# Altium schematic sheet Misc Controls.SchDoc
size C; SheetNumber: 6; SheetTotal: 7
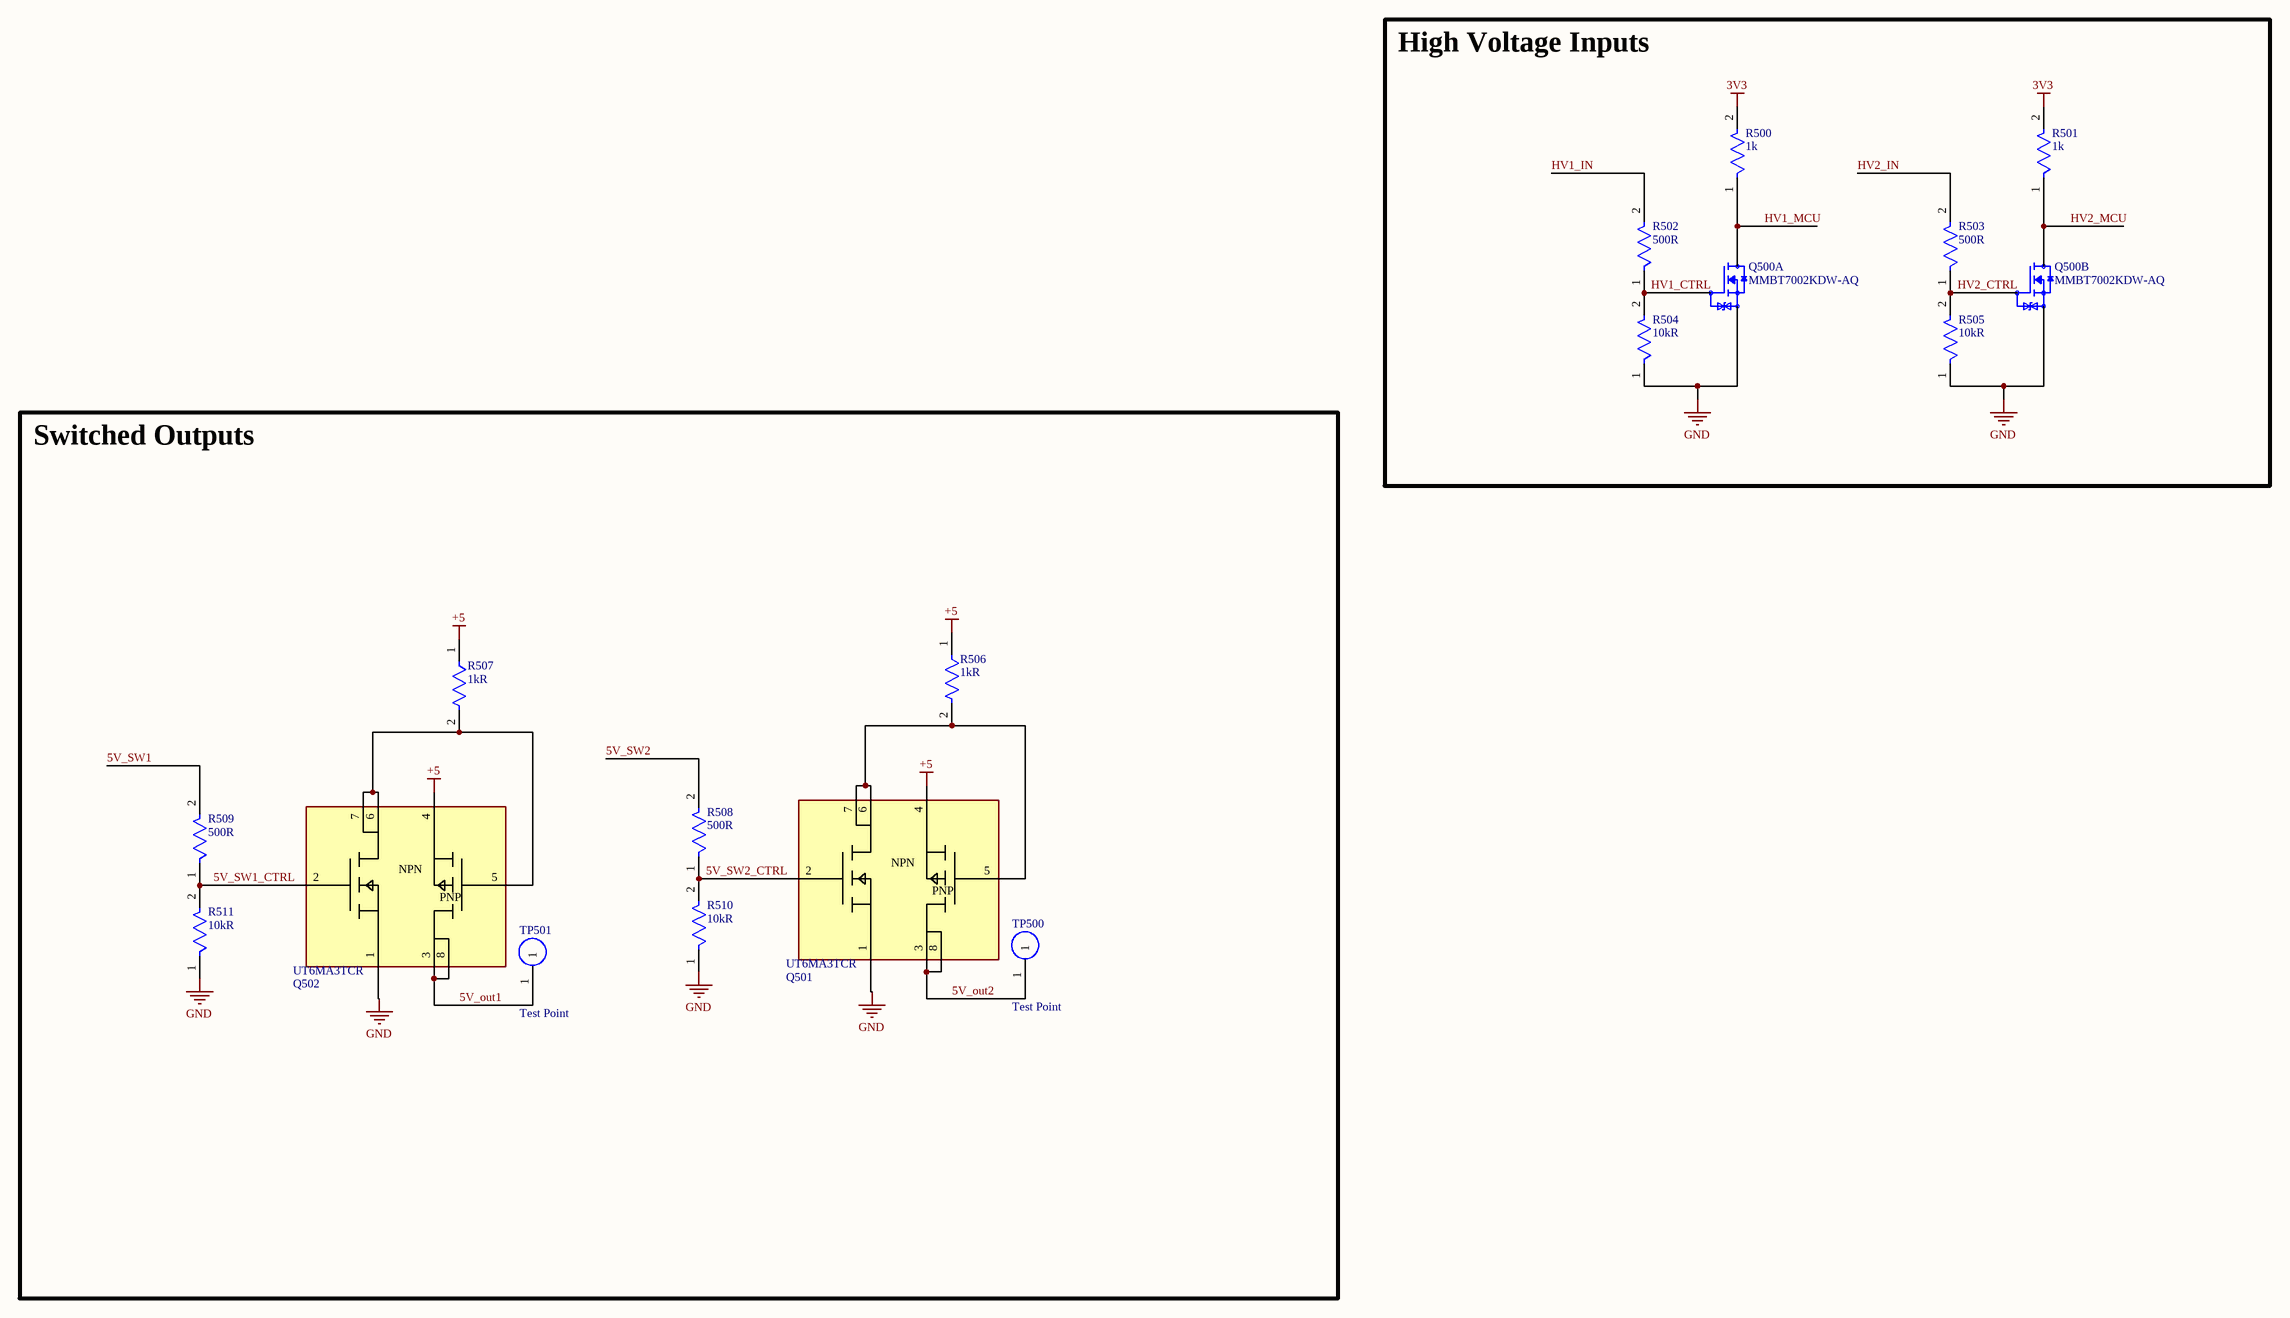
[diagram p0: Misc Controls.SchDoc]

## Parts
Q500  MMBT7002KDW-AQ  [SOT65P210X100-6N]  (parts A,B of 2)
Q501  UT6MA3TCR  [TRANS_UT6J3_ROM]
Q502  UT6MA3TCR  [TRANS_UT6J3_ROM]
R500  value 1k  [FP-CPF0603-MFG]  (hidden comment: CPF0603B2K15E1)
R501  value 1k  [FP-CPF0603-MFG]  (hidden comment: CPF0603B2K15E1)
R502  value 500R  [FP-CPF0603-MFG]  (hidden comment: CPF0603B2K15E1)
R503  value 500R  [FP-CPF0603-MFG]  (hidden comment: CPF0603B2K15E1)
R504  value 10kR  [FP-CPF0603-MFG]  (hidden comment: CPF0603B2K15E1)
R505  value 10kR  [FP-CPF0603-MFG]  (hidden comment: CPF0603B2K15E1)
R506  value 1kR  [FP-CPF0603-MFG]  (hidden comment: CPF0603B2K15E1)
R507  value 1kR  [FP-CPF0603-MFG]  (hidden comment: CPF0603B2K15E1)
R508  value 500R  [FP-CPF0603-MFG]  (hidden comment: CPF0603B2K15E1)
R509  value 500R  [FP-CPF0603-MFG]  (hidden comment: CPF0603B2K15E1)
R510  value 10kR  [FP-CPF0603-MFG]  (hidden comment: CPF0603B2K15E1)
R511  value 10kR  [FP-CPF0603-MFG]  (hidden comment: CPF0603B2K15E1)
TP500  Test Point  [2mm TP]
TP501  Test Point  [2mm TP]

## Blocks framed on the sheet
High Voltage Inputs: Q500 R500-R505
Switched Outputs: Q501 Q502 R506-R511 TP500 TP501

## Nets
3V3: R500.2 R501.2
+5: Q501.4 Q502.4 R506.1 R507.1
GND: Q500.1(S1) Q500.4(S2) Q501.1 Q502.1 R504.1 R505.1 R510.1 R511.1
5V_out1: Q502.3 Q502.8 TP501.1
5V_out2: Q501.3 Q501.8 TP500.1
5V_SW1: R509.2
5V_SW1_CTRL: Q502.2 R509.1 R511.2
5V_SW2: R508.2
5V_SW2_CTRL: Q501.2 R508.1 R510.2
HV1_CTRL: Q500.2(G1) R502.1 R504.2
HV1_IN: R502.2
HV1_MCU: Q500.6(D1) R500.1
HV2_CTRL: Q500.5(G2) R503.1 R505.2
HV2_IN: R503.2
HV2_MCU: Q500.3(D2) R501.1
NetQ501_5: Q501.5 Q501.6 Q501.7 R506.2
NetQ502_5: Q502.5 Q502.6 Q502.7 R507.2

## Notes on the sheet
- (in symbol CMP-009-00178-3) NPN; PNP

## Library data of the parts
Q500 = CMP-075-000000-1: MOSFET, SOT-363, N+N, 60V, 0.3A, 3â„; MF: Diotec Semiconductor; Value: *; Package: SOT-363 Diotec; Pin Count: 6; Source: MMBT7002KDW-AQ.SchLib; SnapEDA_Link: https://www.snapeda.com/parts/MMBT7002KDW-AQ/Diotec/view-part/?ref=snap; Design Item ID: MMBT7002KDW-AQ; MP: MMBT7002KDW-AQ; Check_prices: https://www.snapeda.com/parts/MMBT7002KDW-AQ/Diotec/view-part/?ref=eda; Component Type: Standard; PartId: 1
Q501 Q502 = CMP-009-00178-3: No Description Available; Mfr_Name: ROHM Semiconductor; Type: Type; Design Item ID: UT6MA3TCR; RefDes: RefDes; Source: UT6MA3TCR.SchLib
R500-R511 = CMP-03211-008657-1: RES SMD 2.15KΩ 0.1% 1/16W 0603; Manufacturer: TE Connectivity; Temperature Coefficient: 25ppm/°C; Voltage Rating: 50V; Power Rating: 0.063W; Height: 0.55mm; Series: CPF; ComponentLink2Description: Datasheet; Package: CPF0603; Automotive: No; octopart_url: https://octopart.com/cpf0603b2k15e1-te+connectivity-22739551; Lead Free: Yes; Temperature: -55°C to +155°C; RoHS: TRUE; Ipc Land Pattern Name: RESC15580X45; Temperature Range Low: -55°C; Composition: Thin Film; Device Class L3: Chip SMD Resistors; Category: Res; Octopart: https://octopart.com/cpf0603b2k15e1-te+connectivity-22739551; Resistance: 2.15KΩ; ComponentLink2URL: https://www.te.com/commerce/DocumentDelivery/DDEController?Action=showdoc&DocId=Data+Sheet%7F1773200%7FM%7Fpdf%7FEnglish%7FENG_DS_1773200_M.pdf%7F3-1676481-2; Manufacturer Part Number: CPF0603B2K15E1; packaging: 1k Reel; Tolerance: 0.1%; Temperature Range High: +155°C; Device Class L1: Passive Components; Device Class L2: Resistors
TP500 TP501 = CMP-096-000000-1: Source: Test_Points.SchLib; Design Item ID: Test Point